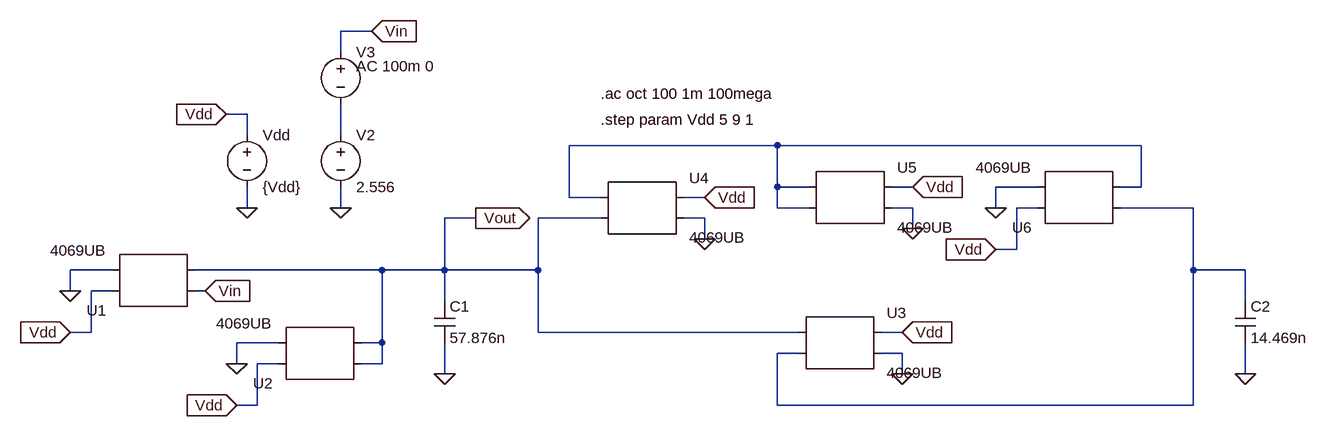
[diagram p0: schematic Q3.asc]
Q3.asc, the LTspice schematic file:
Version 4
SHEET 1 1928 680
WIRE 480 -144 432 -144
WIRE 432 -112 432 -144
WIRE 288 -16 256 -16
WIRE 288 16 288 -16
WIRE 432 16 432 -32
WIRE 1104 32 784 32
WIRE 1664 32 1104 32
WIRE 1104 96 1104 32
WIRE 1152 96 1104 96
WIRE 1312 96 1280 96
WIRE 1504 96 1440 96
WIRE 1664 96 1664 32
WIRE 1664 96 1632 96
WIRE 784 112 784 32
WIRE 832 112 784 112
WIRE 992 112 960 112
WIRE 288 128 288 96
WIRE 432 128 432 96
WIRE 1104 128 1104 96
WIRE 1152 128 1104 128
WIRE 1312 128 1280 128
WIRE 1440 128 1440 96
WIRE 1504 128 1472 128
WIRE 1744 128 1632 128
WIRE 640 144 592 144
WIRE 832 144 736 144
WIRE 992 144 960 144
WIRE 1312 160 1312 128
WIRE 992 176 992 144
WIRE 1472 192 1472 128
WIRE 1472 192 1440 192
WIRE 80 224 16 224
WIRE 496 224 208 224
WIRE 592 224 592 144
WIRE 592 224 496 224
WIRE 736 224 736 144
WIRE 736 224 592 224
WIRE 1744 224 1744 128
WIRE 1824 224 1744 224
WIRE 16 256 16 224
WIRE 80 256 48 256
WIRE 224 256 208 256
WIRE 592 272 592 224
WIRE 1824 272 1824 224
WIRE 48 320 48 256
WIRE 48 320 16 320
WIRE 736 320 736 224
WIRE 1136 320 736 320
WIRE 1296 320 1264 320
WIRE 336 336 272 336
WIRE 496 336 496 224
WIRE 496 336 464 336
WIRE 1136 352 1104 352
WIRE 1296 352 1264 352
WIRE 272 368 272 336
WIRE 336 368 304 368
WIRE 496 368 496 336
WIRE 496 368 464 368
WIRE 592 384 592 336
WIRE 1296 384 1296 352
WIRE 1824 384 1824 336
WIRE 304 432 304 368
WIRE 304 432 272 432
WIRE 1104 432 1104 352
WIRE 1744 432 1744 224
WIRE 1744 432 1104 432
FLAG 1296 320 Vdd
IOPIN 1296 320 In
FLAG 592 384 0
FLAG 640 144 Vout
IOPIN 640 144 Out
FLAG 1296 384 0
FLAG 992 112 Vdd
IOPIN 992 112 In
FLAG 992 176 0
FLAG 1312 96 Vdd
IOPIN 1312 96 In
FLAG 1312 160 0
FLAG 1824 384 0
FLAG 16 320 Vdd
IOPIN 16 320 In
FLAG 288 128 0
FLAG 256 -16 Vdd
IOPIN 256 -16 In
FLAG 224 256 Vin
IOPIN 224 256 In
FLAG 432 128 0
FLAG 480 -144 Vin
IOPIN 480 -144 In
FLAG 16 256 0
FLAG 272 432 Vdd
IOPIN 272 432 In
FLAG 272 368 0
FLAG 1440 192 Vdd
IOPIN 1440 192 In
FLAG 1440 128 0
SYMBOL AutoGenerated/4069UB 144 240 R180
SYMATTR InstName U1
SYMBOL AutoGenerated/4069UB 400 352 R180
SYMATTR InstName U2
SYMBOL cap 576 272 R0
SYMATTR InstName C1
SYMATTR Value 57.876n
SYMBOL AutoGenerated/4069UB 1200 336 R0
SYMATTR InstName U3
SYMBOL AutoGenerated/4069UB 896 128 R0
SYMATTR InstName U4
SYMBOL AutoGenerated/4069UB 1216 112 R0
SYMATTR InstName U5
SYMBOL AutoGenerated/4069UB 1568 112 R180
SYMATTR InstName U6
SYMBOL cap 1808 272 R0
SYMATTR InstName C2
SYMATTR Value 14.469n
SYMBOL voltage 288 0 R0
SYMATTR InstName Vdd
SYMATTR Value {Vdd}
SYMBOL voltage 432 0 R0
SYMATTR InstName V2
SYMATTR Value 2.556
SYMBOL voltage 432 -128 R0
WINDOW 123 24 38 Left 2
SYMATTR Value2 AC 100m 0
SYMATTR InstName V3
SYMATTR Value ""
TEXT 832 -48 Left 2 !.ac oct 100 1m 100mega
TEXT 832 -8 Left 2 !.step param Vdd 5 9 1

The netlist it stands for:
* Q3.asc
* U1: 4069UB (symbol AutoGenerated/4069UB not available, pins judged from their places): pin1=Vin pin2=Vout pin3=Vdd pin4=0
* U2: 4069UB (symbol AutoGenerated/4069UB not available, pins judged from their places): pin1=Vout pin2=Vout pin3=Vdd pin4=0
C1 Vout 0 57.876n
* U3: 4069UB (symbol AutoGenerated/4069UB not available, pins judged from their places): pin1=Vout pin2=N003 pin3=Vdd pin4=0
* U4: 4069UB (symbol AutoGenerated/4069UB not available, pins judged from their places): pin1=N002 pin2=Vout pin3=Vdd pin4=0
* U5: 4069UB (symbol AutoGenerated/4069UB not available, pins judged from their places): pin1=N002 pin2=N002 pin3=Vdd pin4=0
* U6: 4069UB (symbol AutoGenerated/4069UB not available, pins judged from their places): pin1=N003 pin2=N002 pin3=Vdd pin4=0
C2 N003 0 14.469n
Vdd Vdd 0 {Vdd}
V2 N001 0 2.556
V3 Vin N001 AC 100m 0
.ac oct 100 1m 100mega
.step param Vdd 5 9 1
.backanno
.end